# EAGLE design tm_dipole_pt25in (EAGLE 8.2.2)
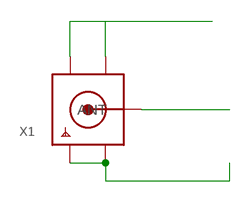
[diagram p0: schematic, sheet 1]

## Parts
X1  SMACONNECTOR  [SMA90_DIP]

## Nets
DRIVEN: X1.ANTENNA(ANT)
RADIAL: X1.GND1 X1.GND2 X1.GND3 X1.GND4

## Library data of the parts
X1 = adafruit:SMACONNECTOR: SMA Connector 90° DIP SMA Connector, 50 Ohm (4UConnector: 07259)

## Board
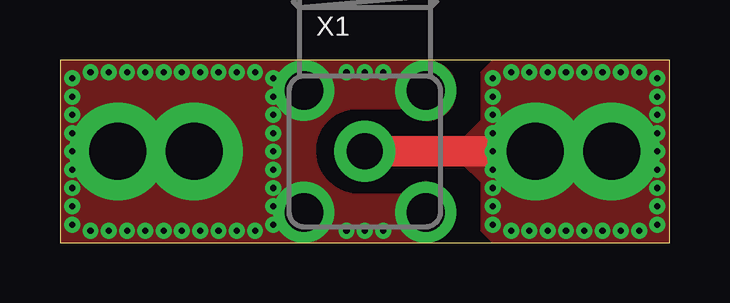
[diagram p1: board, top side]
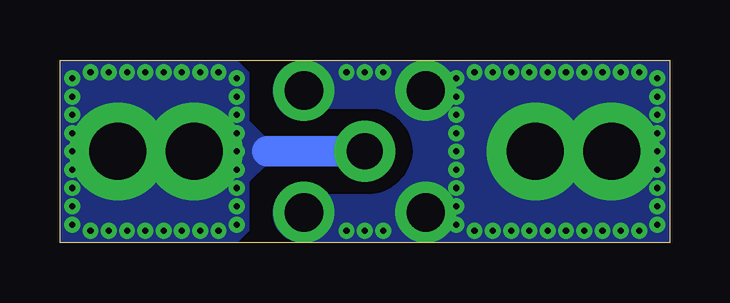
[diagram p2: board, bottom side, seen from below]

Size 25.4 x 7.62 mm. Coordinates in mm from the lower left corner, seen from the top.
Outline: 0,0 25.4,0 25.4,7.62 0,7.62 0,0
Copper layers (1*16): Top 0.035mm / dielectric 1.5mm / Bottom 0.035mm
Design rules "default *": minimum track width 6mil, minimum drill 0.35mm, track to track 6mil, track to pad 6mil, pad to pad 6mil, via to via 6mil, smd to smd 6mil, copper to edge 0mil, drill to drill 6mil, minimum pad ring 10mil, minimum via ring 8mil, stop-mask expansion 4mil, vias tented up to drill 0mil, thermal gap 10mil

### Footprints (pad centres in the part's own frame; a part is rotated, then mirrored left to right if it is on the bottom)
SMA90_DIP = drill 1.5 pad 2.54: ANTENNA 0,0 | drill 1.6 pad 2.54: GND1 -2.54,2.54; GND2 2.54,2.54; GND3 -2.54,-2.54; GND4 2.54,-2.54

### Placement (x,y rotation side)
X1  12.7,3.81 0 top

### Tracks (layer width: path | path; a pad name or v marks a point on that pad's centre or on a via)
DRIVEN  (via drill 0.25, 2.37 pad 4.06)
  Top 1.27: X1.ANTENNA v18.03,3.81
  Bottom 1.27: X1.ANTENNA 16.76,3.81 X1.ANTENNA
  other vias: 22.99,3.81 19.81,3.81 18.03,0.76 18.8,0.51 19.56,0.51 20.32,0.51 21.08,0.51 21.84,0.51 22.61,0.51 23.37,0.51 24.13,0.51 24.89,0.76 18.03,1.52 18.03,2.29 18.03,3.05 18.03,4.57 18.03,5.33 18.03,6.1 18.03,6.86 18.8,7.11 19.56,7.11 20.32,7.11 21.08,7.11 21.84,7.11 22.61,7.11 23.37,7.11 24.13,7.11 24.89,6.86 24.89,6.1 24.89,5.33 24.89,4.57 24.89,3.81 24.89,3.05 24.89,2.29 24.89,1.52
  pour Top (no thermals): 18.03,7.62 17.53,7.11 17.53,5.08 16.76,4.32 16.76,3.3 17.53,2.54 17.53,0.51 18.03,0 25.4,0 25.4,7.62
  pour Bottom (no thermals): 18.03,7.62 17.53,7.11 17.53,5.08 16.76,4.32 16.76,3.3 17.53,2.54 17.53,0.51 18.03,0 25.4,0 25.4,7.62
RADIAL  (via drill 0.25, 2.37 pad 4.06)
  other vias: 2.41,3.81 5.59,3.81 0.51,0.76 1.27,0.51 2.03,0.51 2.79,0.51 3.56,0.51 4.32,0.51 5.08,0.51 5.84,0.51 6.6,0.51 7.37,0.51 8.13,0.51 12.7,0.51 11.94,0.51 13.46,0.51 8.89,0.76 8.89,1.52 8.89,2.29 8.89,3.05 8.89,3.81 8.89,4.57 8.89,5.33 8.89,6.1 0.51,6.86 1.27,7.11 2.03,7.11 2.79,7.11 3.56,7.11 4.32,7.11 5.08,7.11 5.84,7.11 6.6,7.11 7.37,7.11 8.13,7.11 8.89,6.86 0.51,1.52 0.51,2.29 0.51,3.05 0.51,3.81 0.51,4.57 0.51,5.33 0.51,6.1 12.7,7.11 11.94,7.11 13.46,7.11
  pour Top (no thermals): 0,7.62 0,0 15.34,0 arc58 16.49,1.03 16.51,1.27 arc45 15.28,2.54 15.2,2.54 arc45 14.22,2.03 12.74,2.03 arc-90 10.67,3.6 arc-90 12.15,5.59 14.48,5.59 15.24,5.08 arc90 16.51,6.35 arc90 15.24,7.62
  pour Bottom (no thermals): 0,7.62 0,0 15.13,0 arc90 16.51,1.12 16.51,1.27 arc90 15.24,2.54 15.2,2.54 arc45 14.22,2.03 12.7,2.03 arc-90 10.67,3.81 arc-90 12.45,5.59 14.48,5.59 15.24,5.08 arc90 16.51,6.35 arc90 15.24,7.62